# Altium schematic sheet BUS_Board.SchDoc
size A3
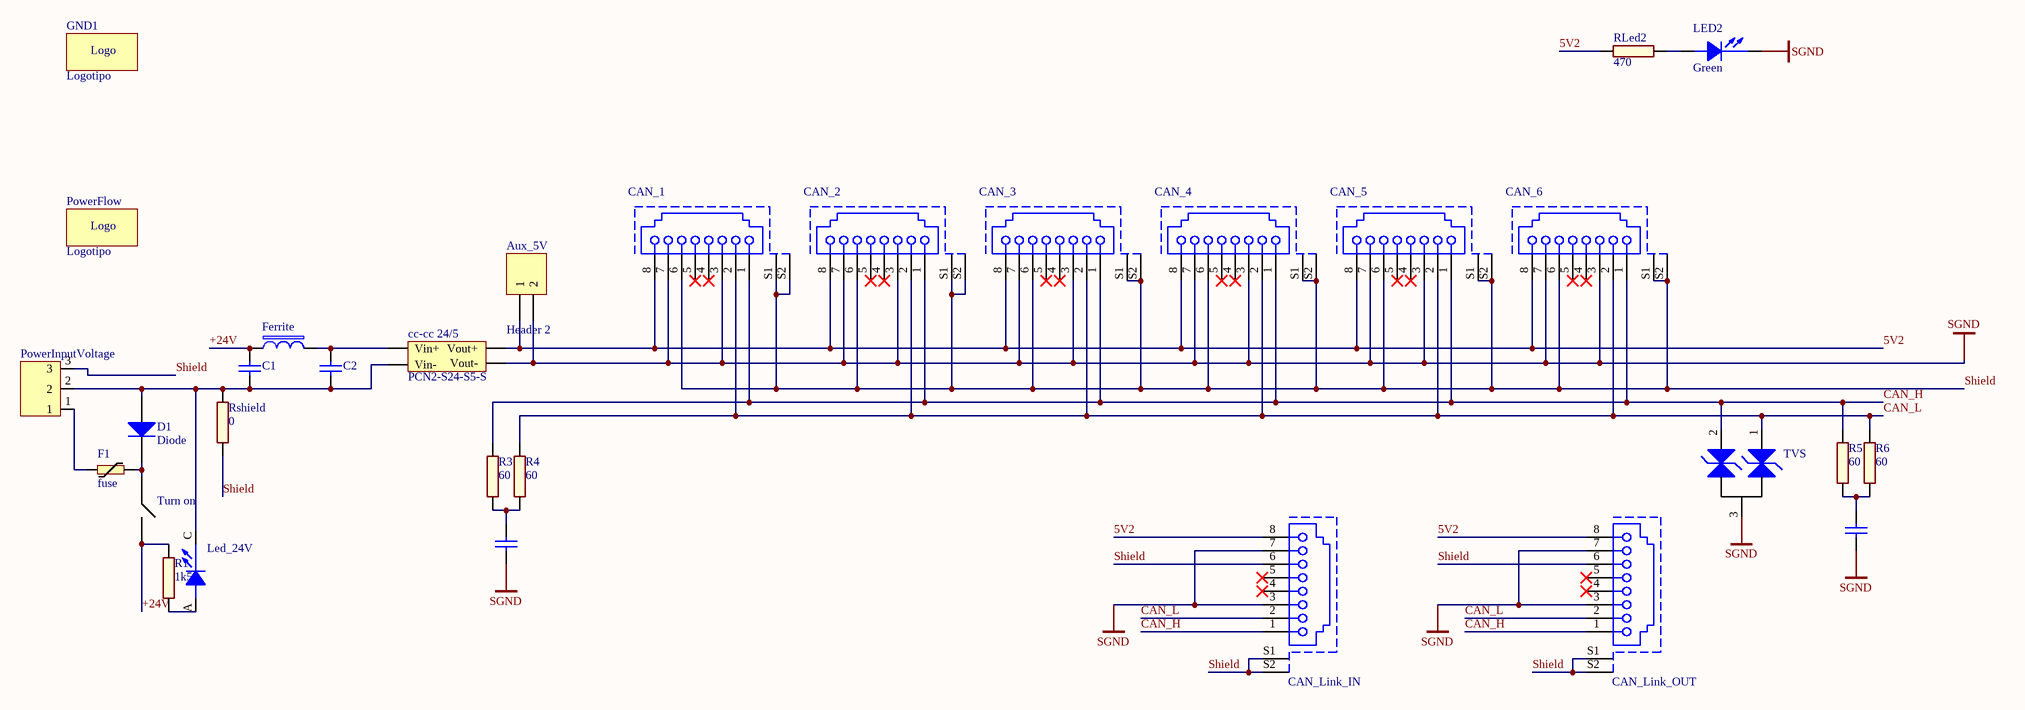
[diagram p0: BUS_Board.SchDoc]

## Parts
Aux_5V  Header 2  [HDR1X2]
C1  Capacitor  [CAPC_1206]  (value not drawn)
C2  Capacitor  [CAPC_1206]  (value not drawn)
CAN_1  61500814221  [61500814221]  (value not drawn)
CAN_2  61500814221  [61500814221]  (value not drawn)
CAN_3  61500814221  [61500814221]  (value not drawn)
CAN_4  61500814221  [61500814221]  (value not drawn)
CAN_5  61500814221  [61500814221]  (value not drawn)
CAN_6  61500814221  [61500814221]  (value not drawn)
CAN_Link_IN  61500814221  [61500814221]  (value not drawn)
CAN_Link_OUT  61500814221  [61500814221]  (value not drawn)
cc-cc_24/5  PCN2-S24-S5-S  [PCN2-S]
CL  Capacitor  [CAPC_0805]  (value not drawn)
CL2  Capacitor  [CAPC_0805]  (value not drawn)
D1  Diode  [Diode_SOD-123]
F1  fuse  [fuse_1206]
Ferrite  Ferrite Bead  [FERR_0805]  (value not drawn)
GND1  Logotipo  [Dangerous_Logo]
LED2  Green  [CD2012-0805]
Led_24V  Green  [CD2012-0805]  (value not drawn)
PowerFlow  Logotipo  [PowerFlow_LOGO]
PowerInputVoltage  con-phoenix-3  [MCV3-LOCK]  (value not drawn)
R1  1k5  [RESC_0805]
R3  60  [RESC_0805]
R4  60  [RESC_0805]
R5  60  [RESC_0805]
R6  60  [RESC_0805]
RLed2  470  [RESC_0805]
Rshield  0  [RESC_0805]
Turn_on  switch_single  [SW-1-A11J]  (value not drawn)
TVS  Diode_TVS_Array  [SOT23-3]  (value not drawn)

## Nets
SGND: Aux_5V.2 CAN_1.3 CAN_1.7 CAN_2.3 CAN_2.7 CAN_3.3 CAN_3.7 CAN_4.3 CAN_4.7 CAN_5.3 CAN_5.7 CAN_6.3 CAN_6.7 CAN_Link_IN.3 CAN_Link_IN.7 CAN_Link_OUT.3 CAN_Link_OUT.7 cc-cc_24/5.4(Vout-) CL.2 CL2.2 LED2.C(CATHODE) TVS.3
5V2: Aux_5V.1 CAN_1.8 CAN_2.8 CAN_3.8 CAN_4.8 CAN_5.8 CAN_6.8 CAN_Link_IN.8 CAN_Link_OUT.8 cc-cc_24/5.6(Vout+) RLed2.1
+24V: C1.2 Ferrite.1 R1.2 Turn_on.2
CAN_H: CAN_1.1 CAN_2.1 CAN_3.1 CAN_4.1 CAN_5.1 CAN_6.1 CAN_Link_IN.1 CAN_Link_OUT.1 R3.2 R5.2 TVS.2
CAN_L: CAN_1.2 CAN_2.2 CAN_3.2 CAN_4.2 CAN_5.2 CAN_6.2 CAN_Link_IN.2 CAN_Link_OUT.2 R4.2 R6.2 TVS.1
Shield: CAN_1.6 CAN_1.S1(Shield) CAN_1.S2(Shield) CAN_2.6 CAN_2.S1(Shield) CAN_2.S2(Shield) CAN_3.6 CAN_3.S1(Shield) CAN_3.S2(Shield) CAN_4.6 CAN_4.S1(Shield) CAN_4.S2(Shield) CAN_5.6 CAN_5.S1(Shield) CAN_5.S2(Shield) CAN_6.6 CAN_6.S1(Shield) CAN_6.S2(Shield) CAN_Link_IN.6 CAN_Link_IN.S1(Shield) CAN_Link_IN.S2(Shield) CAN_Link_OUT.6 CAN_Link_OUT.S1(Shield) CAN_Link_OUT.S2(Shield) PowerInputVoltage.3 Rshield.1
NetC1_1: C1.1 C2.1 cc-cc_24/5.2(Vin-) D1.1(A) Led_24V.C(CATHODE) PowerInputVoltage.2 Rshield.2
NetC2_2: C2.2 cc-cc_24/5.1(Vin+) Ferrite.2
NetCL2_1: CL2.1 R5.1 R6.1
NetCL_1: CL.1 R3.1 R4.1
NetD1_2: D1.2(K) F1.1 Turn_on.1
NetF1_2: F1.2 PowerInputVoltage.1
NetLED2_A: LED2.A(ANODE) RLed2.2
NetLed_24V_A: Led_24V.A(ANODE) R1.1

Not connected (* = marked no-connect by the designer): CAN_1 4* 5*; CAN_2 4* 5*; CAN_3 4* 5*; CAN_4 4* 5*; CAN_5 4* 5*; CAN_6 4* 5*; CAN_Link_IN 4* 5*; CAN_Link_OUT 4* 5*

## Notes on the sheet
- (in symbol Logotipo) Logo

## Library data of the parts
Aux_5V = Header 2: Header, 2-Pin; LatestRevisionDate: 17-Jul-2002; LatestRevisionNote: Re-released for DXP Platform.; Publisher: Altium Limited
C1 C2 = Capacitor: Value: 10uF; Voltage: 50 V
CAN_1-CAN_6 CAN_Link_IN CAN_Link_OUT = 61500814221: Modular Jack Horizontal Shielded 8P8C Tab Down WR-MJ; Rated Current: 1.5 A; Working Voltage: 120 VAC; Withstanding Voltage: 1000 VAC; Port: 1x1; ComponentLink1Description: Manufacturer; ComponentLink1URL: http://www.we-online.de; ComponentLink2Description: Datasheet; ComponentLink2URL: http://katalog.we-online.com/em/datasheet/61500814221.pdf; Part Number: 61500814221; Published Date: September 2017; Publisher: Wurth Elektronik; Pin Number: 8P8C; Entrance: Horizontal
CL CL2 = Capacitor: Value: 4.7 nF
Ferrite = Ferrite Bead: Value: 5.6 uH
LED2 = LED_GREEN: LED 2X1.2MM 570NM GN WTR CLR SMD; Manufacturer: Kingbright; MPN: APT2012CGCK; VPN: 754-1127-1-ND; Vendor: Digikey; Value: Green
Led_24V = LED_GREEN: LED 2X1.2MM 570NM GN WTR CLR SMD; Manufacturer: Kingbright; MPN: APT2012CGCK; Vendor: Digikey; VPN: 754-1127-1-ND; Value: Green
R1 R3-R6 RLed2 Rshield = R2: Thick film resistor, SMD 0402, 1/16W, 1%; Manufacturer: Generic
  R1: Value: 1k5
  R3-R6: Value: 60
  RLed2: Value: 470
  Rshield: Value: 0
TVS = Diode_TVS_Array: Value: SM24CANB-02HTG